# Altium schematic sheet P09_DRV2605L Motor Driver.SchDoc
size A
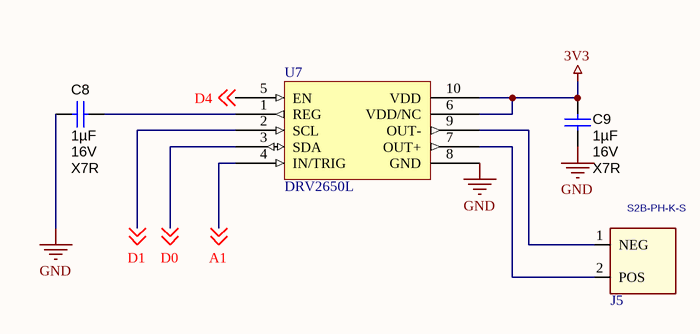
[diagram p0: P09_DRV2605L Motor Driver.SchDoc]

## Parts
C8  ValueDisplayed: 1µF  Value2: 16V  TempCo: X7R  [0603]  (hidden comment: C1608X7R1C105K)
C9  ValueDisplayed: 1µF  Value2: 16V  TempCo: X7R  [0603]  (hidden comment: C1608X7R1C105K)
J5  S2B-PH-K-S  [S2B-PH-K-S]
U7  DRV2650L  [DGS0010A_N]

## Nets
3V3: C9.1 U7.6(VDD/NC) U7.10(VDD)
GND: C8.2 C9.2 U7.8(GND)
A1: U7.4(IN/TRIG) ; off-sheet A1
D0: U7.3(SDA) ; off-sheet D0
D1: U7.2(SCL) ; off-sheet D1
D4: U7.5(EN) ; off-sheet D4
NetC8_1: C8.1 U7.1(REG)
NetJ5_1: J5.1(NEG) U7.9(OUT-)
NetJ5_2: J5.2(POS) U7.7(OUT+)

## Library data of the parts
C8 C9 = C1608X7R1C105K: CAP, CERM, 1 µF, 16 V, +/- 10%, X7R, 0603; Manufacturer: TDK; Polarized: N; CompType: Capacitor; Value: 1uF; U/M: EA; Cap_F: 0.000001; Tolerance_%: 10; ESR_ohm: 0.0057; Value1: 0.0057 ohm; VDC_V: 16; TaMin_C: -55; TaMax_C: 125; SymbolVersion: 2008-07-09; PartNumber: C1608X7R1C105K; PackageReference: 0603; RoHS: Y; MountType: SMT; Technology: Ceramic; Cap_Case: 0603; Published: 2008-06-19; Publisher: Texas Instruments; LatestRevisionDate: 2014-09-22; ComponentLink1Description: Datasheet link; ComponentLink1URL: http://www.tdk.co.jp/tefe02/e412_c.pdf; Supplier 1: Digi-Key; Supplier Part Number 1: 445-1604-1-ND; Supplier 2: Farnell; Supplier Part Number 2: 1907343
J5 = S2B-PH-K-S: 2 Positions Header, Shrouded Connector 0.079" (2.00mm) Through Hole, Right Angle Tin